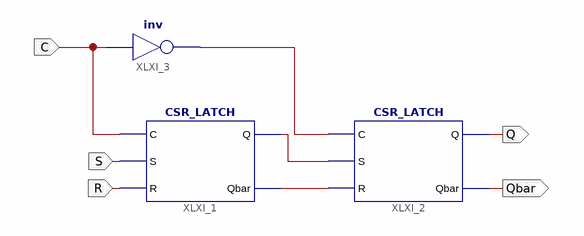
[diagram p0: schematic sheet 1]
// Xilinx ISE schematic MS_FLIPFLOP.sch (kintex7) as structural Verilog: 3 symbols, 5 ports
module MS_FLIPFLOP (
  input  C,
  input  S,
  input  R,
  output Q,
  output Qbar
);

  wire XLXN_2, XLXN_3, XLXN_4;

  CSR_LATCH XLXI_1 (.C(C), .S(S), .R(R), .Q(XLXN_3), .Qbar(XLXN_4));
  CSR_LATCH XLXI_2 (.C(XLXN_2), .S(XLXN_3), .R(XLXN_4), .Q(Q), .Qbar(Qbar));
  not XLXI_3 (XLXN_2, C);
endmodule
